# EAGLE design CC1101_reva (EAGLE 7.7.0)

## Sheet 1 of 2
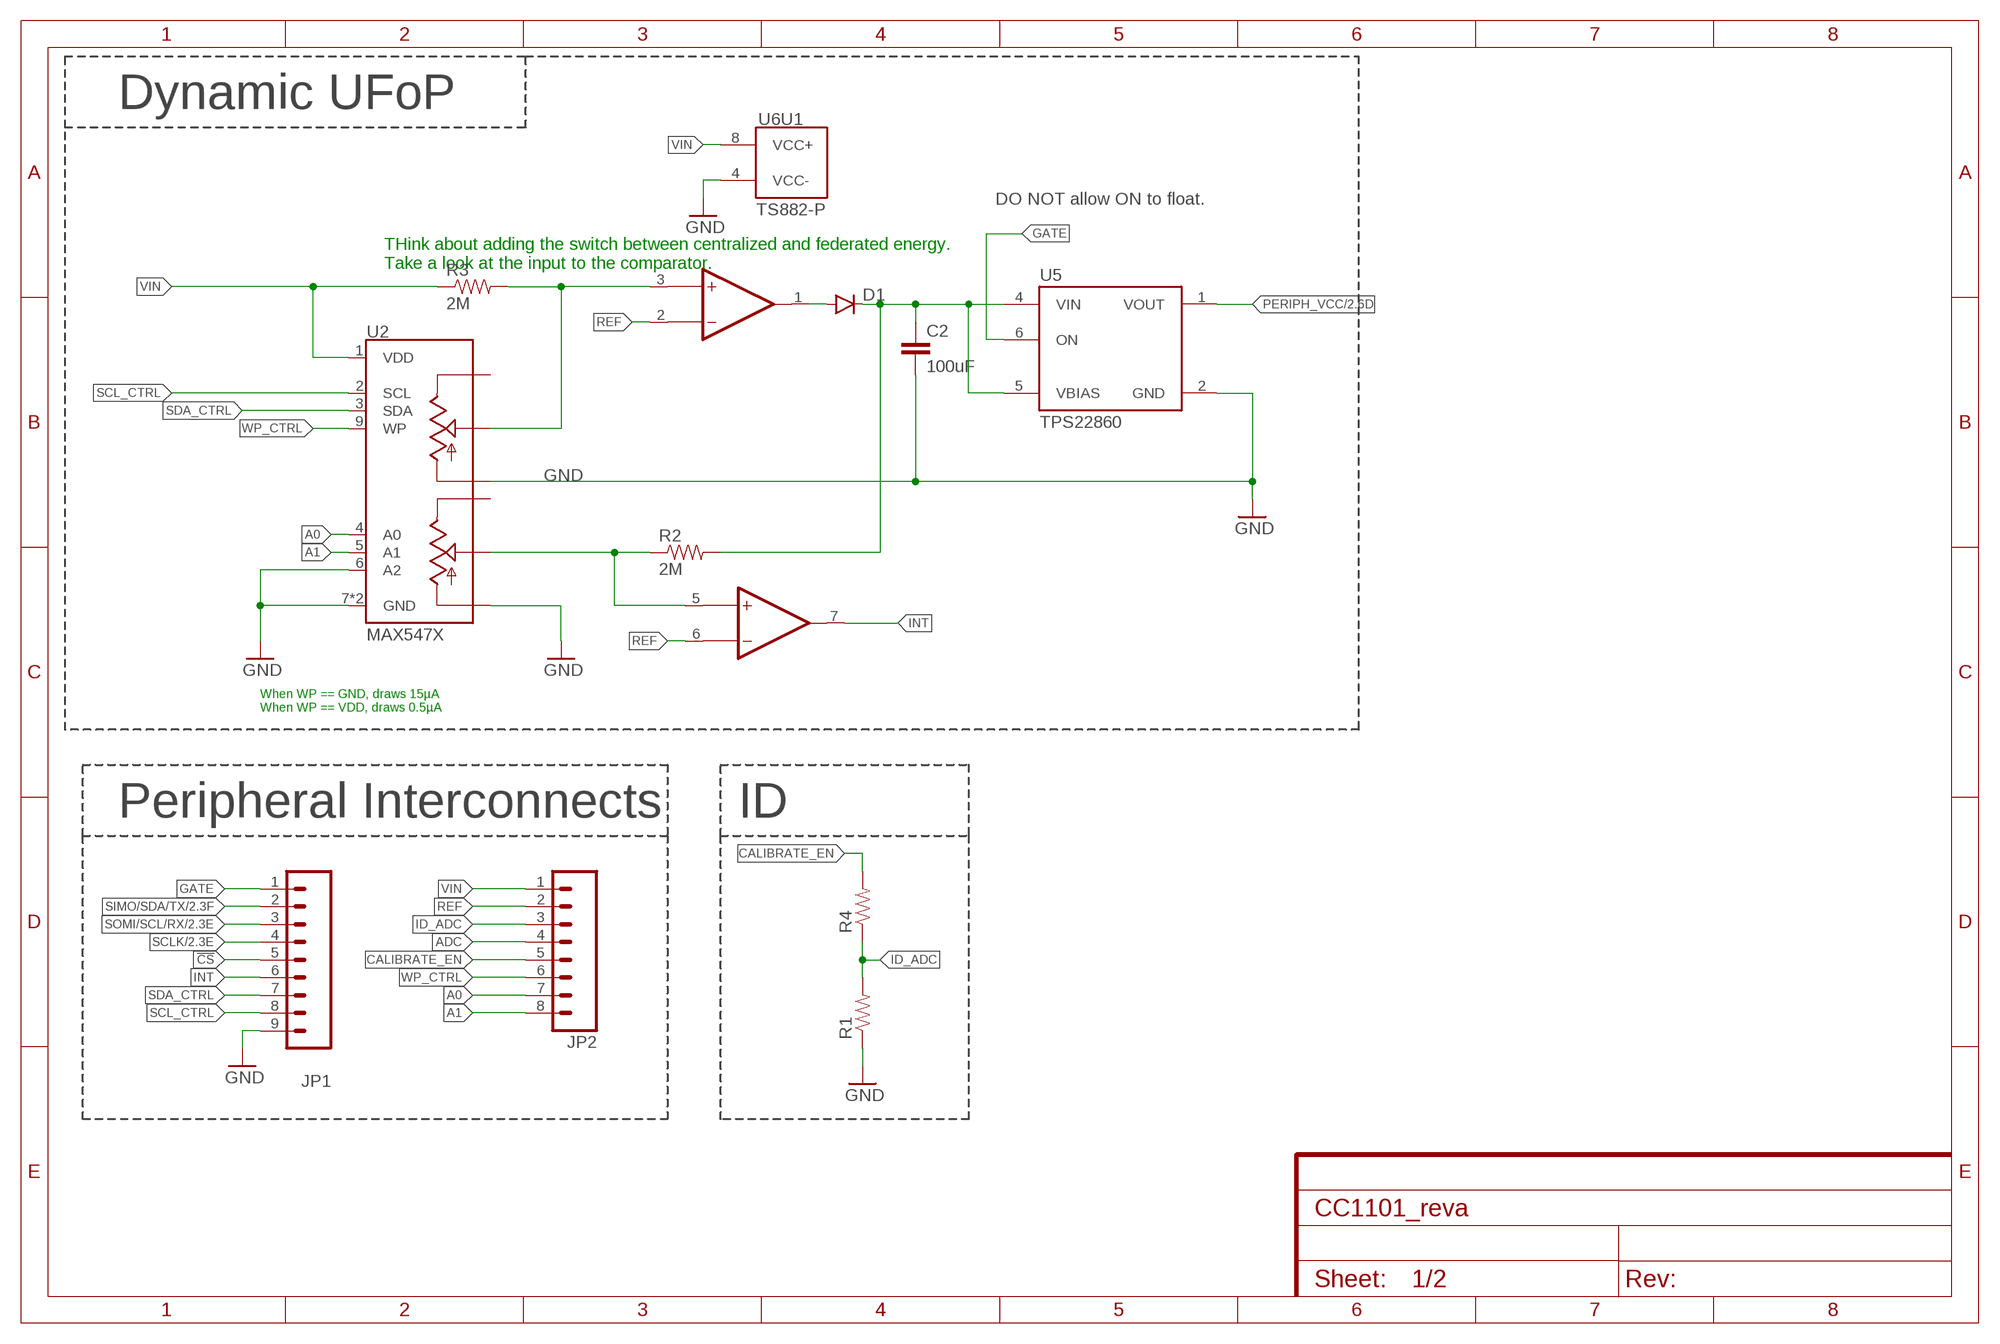
[diagram p0: schematic, sheet 1]
FRAME2 (FRAME-A4L): CNAME: Humidity Peripheral, Si7021; CREVISION: A; DESIGNER: Josiah Hester

### Parts
C2  100uF  CAP1210  [1210]
D1  DIODESOD523  [SOD523]
JP1  M091.27MM  [1X09-1.27MM]
JP2  M081.27MM  [1X08-1.27MM]
R1  R-EU0603  [0603]
R2  2M  R-EU0603  [0603]
R3  2M  R-EU0603  [0603]
R4  R-EU0603  [0603]
U2  MAX547X  [QFN16]
U5  TPS22860  [TSOT23-6]
U6  TS882-P  [UDFN8]

### Nets
!CS: JP1.5 ; also sheet 2
A0: JP2.7 U2.4(A0)
A1: JP2.8 U2.5(A1)
ADC: JP2.4
CALIBRATE_EN: JP2.5 R4.2
GATE: JP1.1 U5.6(ON)
GND: C2.2 JP1.9 R1.1 U2.6(A2) U2.7(GND) U2.10(LB) U2.13(LA) U2.TH(GND) U5.2(GND) U6.4(U1:VCC-) ; also sheet 2
ID_ADC: JP2.3 R1.2 R4.1
INT: JP1.6 U6.7(OP2:OUT1)
N$2: C2.1 D1.C R2.2 U5.4(VIN) U5.5(VBIAS)
N$4: R3.2 U2.14(WA) U6.3(OP1:IN1+)
N$5: R2.1 U2.11(WB) U6.5(OP2:IN1+)
N$11: D1.A U6.1(OP1:OUT1)
PERIPH_VCC: U5.1(VOUT) ; also sheet 2
REF: JP2.2 U6.2(OP1:IN1-) U6.6(OP2:IN1-)
SCL_CTRL: JP1.8 U2.2(SCL)
SCLK: JP1.4 ; also sheet 2
SDA_CTRL: JP1.7 U2.3(SDA)
SIMO/SDA/TX: JP1.2 ; also sheet 2
SOMI/SCL/RX: JP1.3 ; also sheet 2
VIN: JP2.1 R3.1 U2.1(VDD) U6.8(U1:VCC+)
WP_CTRL: JP2.6 U2.9(WP)
Unconnected: U2.12(HB) U2.15(HA)

### Notes on the sheet
- Dynamic UFoP
- DO NOT allow ON to float.
- THink about adding the switch between centralized and federated energy.
  Take a look at the input to the comparator.
- When WP == GND, draws 15µA
  When WP == VDD, draws 0.5µA
- Peripheral Interconnects | ID

## Sheet 2 of 2
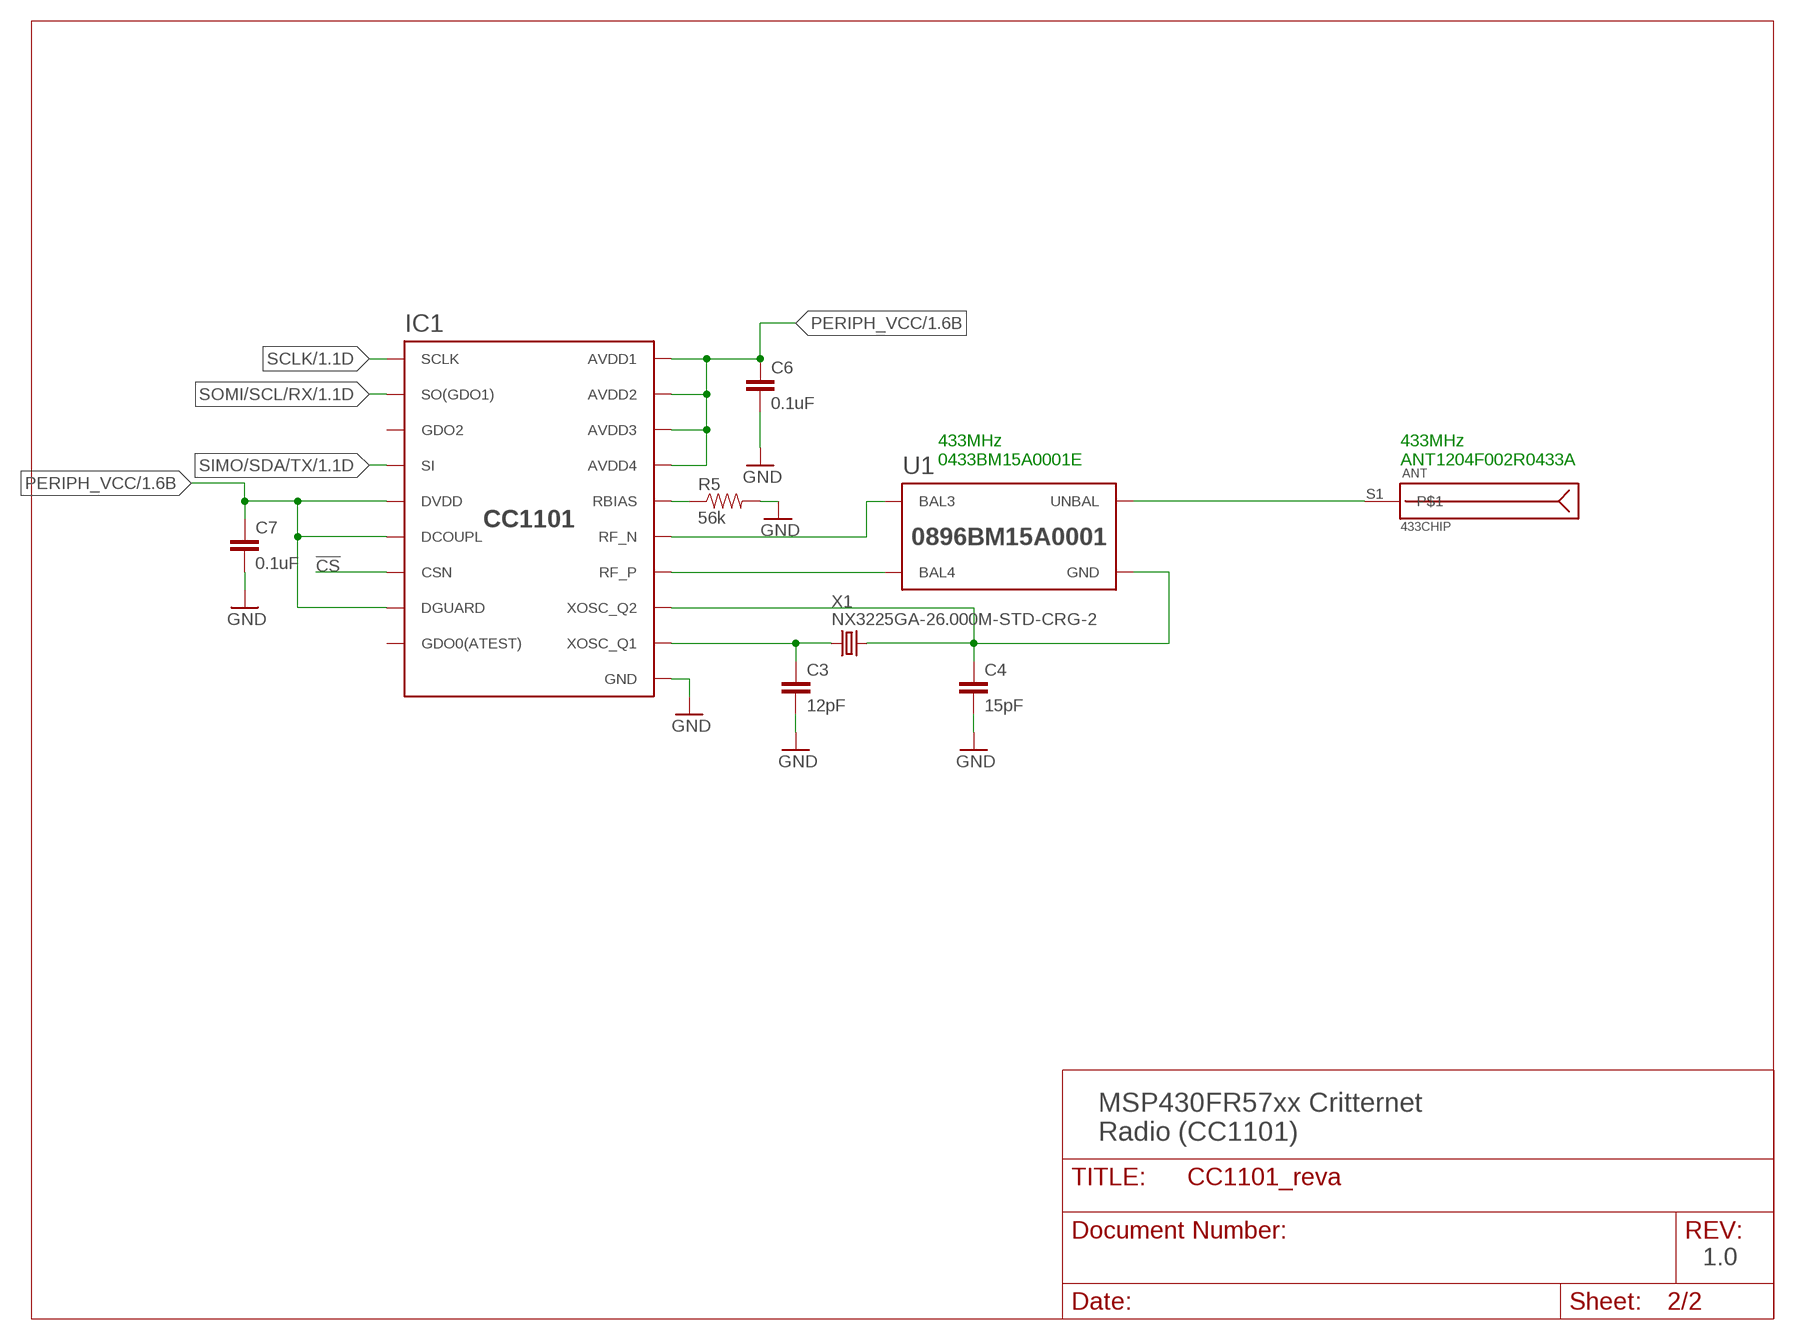
[diagram p1: schematic, sheet 2]

### Parts
ANT  433CHIP  [ANT-433-USP]
C3  12pF  C-EU0603  [0603]
C4  15pF  C-EU0603  [0603]
C6  0.1uF  C-EU0603  [0603]
C7  0.1uF  C-EU0603  [0603]
IC1  CC1101  [QLP20]
R5  56k  R-EU0603  [0603]
U1  0896BM15A0001  [0896BM15A0001]
X1  NX3225GA-26.000M-STD-CRG-2  XTAL-3.2X2.5  [XTAL-3.2X2.5]

### Nets
!CS: IC1.7(CSN) ; also sheet 1
GND: C3.2 C4.2 C6.2 C7.2 IC1.16(GND) IC1.19(GND) IC1.GND R5.2 ; also sheet 1
N$1: IC1.12(RF_P) U1.4(BAL4)
N$3: IC1.13(RF_N) U1.3(BAL3)
N$6: C3.1 IC1.8(XOSC_Q1) X1.1
N$7: IC1.17(RBIAS) R5.1
N$15: ANT.S1 U1.1(UNBAL)
PERIPH_VCC: C6.1 C7.1 IC1.4(DVDD) IC1.5(DCOUPL) IC1.9(AVDD1) IC1.11(AVDD2) IC1.14(AVDD3) IC1.15(AVDD4) IC1.18(DGUARD) ; also sheet 1
SCLK: IC1.1(SCLK) ; also sheet 1
SIMO/SDA/TX: IC1.20(SI) ; also sheet 1
SOMI/SCL/RX: IC1.2(SO(GDO1)) ; also sheet 1
XOSC_Q2: C4.1 IC1.10(XOSC_Q2) U1.2(GND) U1.5(GND) U1.6(GND) X1.3
Unconnected: IC1.3(GDO2) IC1.6(GDO0(ATEST))

### Notes on the sheet
- 433MHz
  0433BM15A0001E
- 433MHz
  ANT1204F002R0433A
- MSP430FR57xx Critternet
  Radio (CC1101)
- 1.0

## Library data of the parts
ANT = HF-Bauteile:433CHIP
C2 = SparkFun-Capacitors:CAP: Capacitor Standard 0603 ceramic capacitor, and 0.1" leaded capacitor.; DIGIKEY: 490-9969-1-ND
C3 C4 C6 C7 = tiny_passives:C-EU
D1 = SparkFun-DiscreteSemi:DIODE: Diode These are standard reverse protection diodes and small signal diodes. SMA package can handle up to about 1A. SOD-323 can handle about 200mA. What the SOD-323 package when ordering, there are some mfgs out there that are 5-pin packages.
IC1 = cc1101:CC1101
JP1 = SparkFun-Connectors:M09: Header 9 Standard 9-pin 0.1" header. Use with straight break away headers (SKU : PRT-00116), right angle break away headers (PRT-00553), swiss pins (PRT-00743), machine pins (PRT-00117), and female headers (PRT-00115).
JP2 = SparkFun-Connectors:M08: Header 8 Standard 8-pin 0.1" header. Use with straight break away headers (SKU : PRT-00116), right angle break away headers (PRT-00553), swiss pins (PRT-00743), machine pins (PRT-00117), and female headers (PRT-00115).
R1 R3-R5 = tiny_passives:R-EU
R2 = tiny_passives:R-EU; DIGIKEY: 311-2.00MHRCT-ND
U1 = otternet:0896BM15A0001
U2 = max547x:MAX547X: MAXIM MAX547X: Dual, 256-Tap, Nonvolatile, I2C-Interface, Digital Potentiometers, 400nA Iq, 250µA 12ms write The MAX5477/MAX5478/MAX5479 nonvolatile, dual, linear-taper, digital potentiometers perform the function of a mechanical potentiometer, but replace the mechanics with a simple 2-wire digital interface. Each device performs the same function as a discrete potentiometer or variable resistor and has 256 tap points. The devices feature an internal, nonvolatile EEPROM used to store the wiper position for initialization during power-up. A write-protect feature prevents accidental overwrites of the EEPROM. The fast-mode I2C-compatible serial interface allows communication at data rates up to 400kbps, minimizing board space and reducing interconnection complexity in many applications. Three address inputs allow a total of eight unique address combinations.; DIGIKEY: MAX5479ETE+-ND
U5 = tps22860:TPS22860: TI: TPS22860 Ultra-Low Leakage Load Switch The TPS22860 is a small, ultra-low leakage current, single channel load switch. The device requires a VBIAS voltage and can operate over an input voltage range of 0 V to VBIAS. It can support a maximum continuous current of 200 mA. The switch is controlled by an on/off input (ON), which is capable of interfacing directly with low-voltage control signals. The TPS22860 is available in two small, space-saving 6-pin SOT-23 and SC70 packages. The device is characterized for operation over the free-air temperature range of –40°C to 85°C.; DIGIKEY: 296-43982-1-ND
U6 = ts882:TS882-P; DIGIKEY: 497-14073-1-ND
X1 = cc1101:XTAL

## Net classes
1 Ground: width 0.203 mm, drill 0.61 mm

## Board
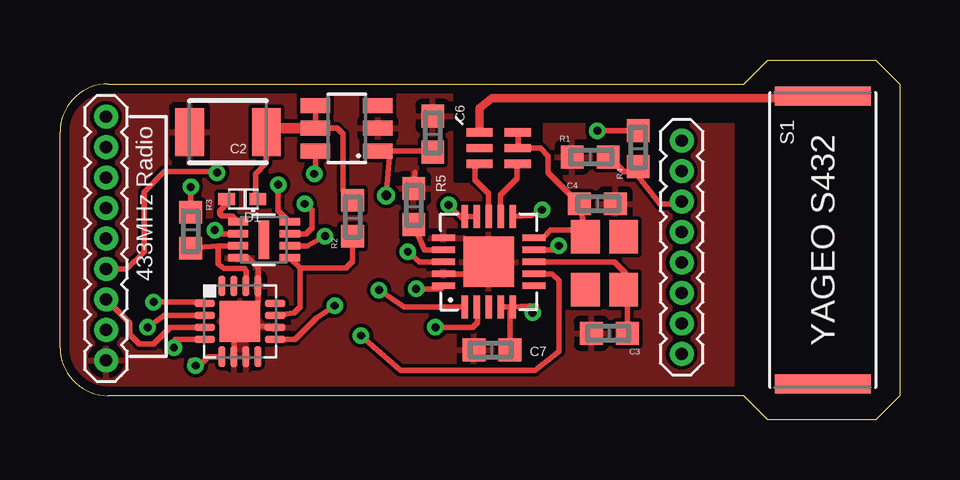
[diagram p2: board, top side]
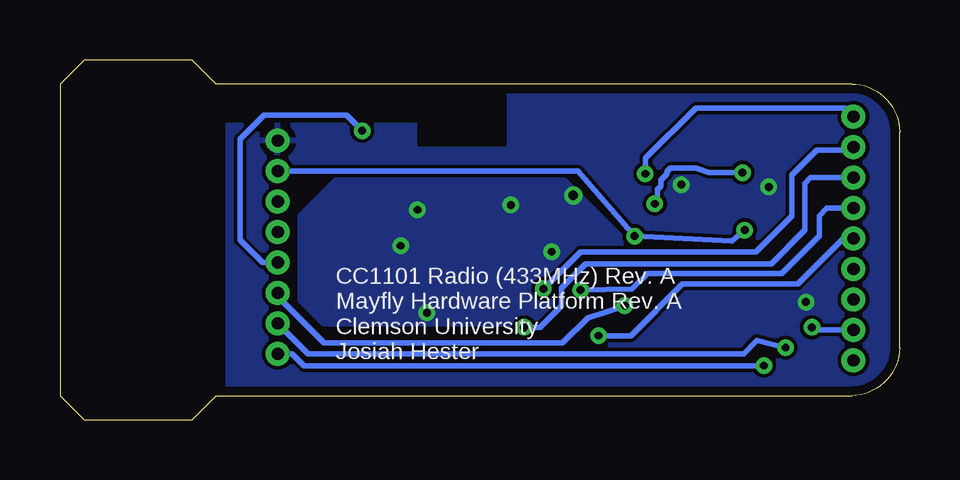
[diagram p3: board, bottom side, seen from below]

Size 35 x 15 mm. Coordinates in mm from the lower left corner, seen from the top.
Outline: 2,14 28.5,14 29.5,15 34,15 35,14 35,1 34,0 29.5,0 28.5,1 2,1 arc-90 0,3 0,12 arc-90 2,14
Copper layers (1*16): Top 0.0356mm / dielectric 1.5011mm / Bottom 0.0356mm
Design rules "LaenPCBOrder": minimum track width 6mil, minimum drill 13mil, track to track 6mil, track to pad 6mil, pad to pad 6mil, via to via 6mil, smd to smd 6mil, copper to edge 15mil, drill to drill 6mil, minimum pad ring 7mil, minimum via ring 7mil, stop-mask expansion 3mil, vias tented up to drill 0mil, thermal gap 10mil

### Footprints (pad centres in the part's own frame; a part is rotated, then mirrored left to right if it is on the bottom)
ANT-433-USP = smd 0.8 x 4: P$4 6,0; S1 -6,0
1210 = smd 1.2 x 2: 1 -1.6,0; 2 1.6,0
0603 = smd 0.95 x 0.95: 1 -0.75,0; 2 0.75,0
SOD523 = smd 0.7 x 0.5: A 0.7,0; C -0.6,0
QLP20 = smd 0.96 x 0.28: 1 -1.88,1; 2 -1.88,0.5; 3 -1.88,0; 4 -1.88,-0.5; 5 -1.88,-1; 11 1.88,-1; 12 1.88,-0.5; 13 1.88,0; 14 1.88,0.5; 15 1.88,1 | smd 0.28 x 0.96: 6 -1,-1.88; 7 -0.5,-1.88; 8 0,-1.88; 9 0.5,-1.88; 10 1,-1.88; 16 1,1.88; 17 0.5,1.88; 18 0,1.88; 19 -0.5,1.88; 20 -1,1.88 | smd 2.1 x 2.1: GND 0,0
1X09-1.27MM = drill 0.508 pad 1: 1 0,0; 2 1.27,0; 3 2.54,0; 4 3.81,0; 5 5.08,0; 6 6.35,0; 7 7.62,0; 8 8.89,0; 9 10.16,0
1X08-1.27MM = drill 0.508 pad 1: 1 0,0; 2 1.27,0; 3 2.54,0; 4 3.81,0; 5 5.08,0; 6 6.35,0; 7 7.62,0; 8 8.89,0
0896BM15A0001 = smd 0.35 x 1.1: 1 0.65,0.8; 2 0,0.8; 3 -0.65,0.8; 4 -0.65,-0.8; 5 0,-0.8; 6 0.65,-0.8
QFN16 = smd 0.85 x 0.3: 1 -1.475,0.75; 2 -1.475,0.25; 3 -1.475,-0.25; 4 -1.475,-0.75; 9 1.475,-0.75; 10 1.475,-0.25; 11 1.475,0.25; 12 1.475,0.75 | smd 0.3 x 0.85: 5 -0.75,-1.475; 6 -0.25,-1.475; 7 0.25,-1.475; 8 0.75,-1.475; 13 0.75,1.475; 14 0.25,1.475; 15 -0.25,1.475; 16 -0.75,1.475 | smd 1.7 x 1.7: TH 0,0
TSOT23-6 = smd 0.62 x 1.22: 1 -0.95,-1.3; 2 0,-1.3; 3 0.95,-1.3; 4 0.95,1.3; 5 0,1.3; 6 -0.95,1.3
UDFN8 = smd 0.3 x 0.85: 1 -0.75,-1.075; 2 -0.25,-1.075; 3 0.25,-1.075; 4 0.75,-1.075; 5 0.75,1.075; 6 0.25,1.075; 7 -0.25,1.075; 8 -0.75,1.075 | smd 1.6 x 0.45: TH 0,0
XTAL-3.2X2.5 = smd 1.4 x 1.2: 1 -1.1,-0.8; 2 1.1,-0.8; 3 1.1,0.8; 4 -1.1,0.8

### Placement (x,y rotation side)
ANT  31.8,7.49 270 top
C2  7,12 180 top
C3  22.9,3.6 180 top
C4  22.4,9 0 top
C6  15.54,11.91 90 top
C7  18.01,2.9 180 top
D1  7.65,9.2 180 top
IC1  17.87,6.58 90 top
JP1  1.92,12.63 270 top
JP2  25.92,11.63 270 top
R1  22.1,10.95 0 top
R2  12.2,8.4 90 top
R3  5.45,7.9 270 top
R4  24.1,11.3 90 top
R5  14.75,8.89 90 top
U1  18.29,11.32 90 top
U2  7.5,4.1 0 top
U5  11.95,12.15 90 top
U6  8.5,7.5 270 top
X1  22.7,6.52 90 top

### Tracks (layer width: path | path; a pad name or v marks a point on that pad's centre or on a via)
!CS  (via drill 0.33)
  Top 0.222: IC1.7 20.52,6.08 20.8,5.8 20.8,2.85 19.8,2.05 14.2,2.05 v12.55,3.5
  Bottom 0.222: JP1.5 2.35,7.55 4.25,5.65 9.05,5.65 11.2,3.5 v12.55,3.5
A0  (via drill 0.33)
  Top 0.222: v4.75,3 4.8,3.35 U2.4
  Bottom 0.222: v4.75,3 5.95,3.3 6.5,2.75 24.66,2.75 JP2.7
A1  (via drill 0.33)
  Top 0.222: v5.65,2.25 5.45,2.45 5.8,2.25 6.17,2.62 U2.5
  Bottom 0.222: JP2.8 25.32,2.74 24.83,2.25 v5.65,2.25
CALIBRATE_EN  (via drill 0.33)
  Top 0.222: v22.4,12.05 R4.2
  Bottom 0.222: JP2.5 26.55,6.55 27.5,7.5 27.5,11.7 26.5,12.7 23.05,12.7 v22.4,12.05
GATE  (via drill 0.33)
  Top 0.222: U5.6 10.65,10.65 v10.6,10.25
  Bottom 0.222: JP1.1 2.29,13 8.5,13 10.6,10.9 v10.6,10.25
GND
  Top 0.222: U2.10 7.75,3.95 U2.TH | U2.TH 8.25,4.95 U2.13 8.25,6.35 7.85,6.75 U6.4 | U2.6 7.25,3.95 U2.TH | R5.2 14.8,10.29 | IC1.19 17.58,6.08 18,6.5
  pour Top: -0.5,1 28,1 28,14.5 -0.5,14.5
ID_ADC
  Top 0.222: JP2.3 25.83,9 25,9 24.1,10.15 R4.1 23.9,10.35 23.5,10.35 22.9,10.95 R1.2
INT  (via drill 0.33)
  Top 0.222: U6.7 10.25,7.75 10.5,8 10.5,8.75 v10.2,9 | JP1.6 2.78,6.28 3.5,7 3.5,9.5 4.35,10.35 6.15,10.35 v6.55,10.3
  Bottom 0.222: v6.55,10.3 7.95,10.3 8.5,10.5 9.55,10.5 9.7,10.35 9.7,10.25 9.95,10 9.95,9.75 10.1,9.6 10.1,9.1 v10.2,9
N$1
  Top 0.222: IC1.12 18.37,9.37 19.05,10.05 19.05,10.63 U1.4
N$2
  Top 0.222: U5.4 U5.5 11.55,12.15 11.8,11.9 11.8,9.55 R2.2 | D1.C 8.15,9.2 8.15,10.25 8.6,10.7 C2.1
  Top 0.44: U5.5 8.75,12.15 C2.1
N$3
  Top 0.222: IC1.13 17.87,9.43 17.3,10 17.3,10.48 U1.3
N$4
  Top 0.222: U6.3 6.6,7.25 | 6.6,7.25 R3.2 | U2.14 7.75,6.2 7.7,6.3 6.85,6.3 6.6,6.5 6.6,7.25
N$5
  Top 0.222: U2.11 9.75,4.45 10,4.7 10,6.33 | 10,6.33 U6.5 | 10,6.33 11.93,6.33 12.2,6.6 R2.1
N$6
  Top 0.222: C3.1 23.65,4.66 X1.1 23.6,5.51 23.6,6.1 23.12,6.58 IC1.8
N$7
  Top 0.222: IC1.17 15.2,7.08 R5.1
N$9
  cutout Top: 18,14 29,14 29,12.5 20,12.5 20,10 16.5,10 16.5,14
N$10
  cutout Bottom: 16.5,14 29,14 29,12.5 20,12.5 20,11.5 16.5,11.5
N$11
  Top 0.222: U6.1 7.17,8.5 6.75,8.5 6.65,8.6 6.65,8.7 6.95,9 D1.A
N$15
  Top 0.35: U1.1 17.49,12.99 18,13.4 31.79,13.4 ANT.S1
PERIPH_VCC  (via drill 0.33, 0.4)
  Top 0.222: U5.1 13.75,11.2 | 13.75,11.2 v13.6,9.35 | v16.2,8.95 16.87,8.3 IC1.15 | IC1.15 IC1.14 | IC1.18 14.98,6.58 v14.5,7 | IC1.11 19.66,8.51 v20.1,8.75 | IC1.4 IC1.5 | IC1.5 19.85,4.75 v19.7,4.45 | C7.1 18.76,4.49 IC1.5 | 16.9,8.29 IC1.15 | IC1.9 20.77,7.08 v20.8,7.25 | 13.75,11.2 15.38,11.2 C6.1
  pour Bottom: 14,10 23.5,10 25,8.5 25,5 24,4 11.5,4 11,4.5 11,7
REF  (via drill 0.33)
  Top 0.222: v11.05,7.65 10.3,7.25 U6.6 | U6.2 6.6,7.75 v6.45,7.9
  Bottom 0.222: JP2.2 13.41,10.36 v11.05,7.65 7,7.45 v6.45,7.9
SCL_CTRL  (via drill 0.33)
  Top 0.222: v3.65,3.85 4.35,4.35 U2.2
  Bottom 0.222: JP1.8 3.54,3.74 v3.65,3.85
SCLK  (via drill 0.33)
  Top 0.222: IC1.1 15.2,4.7 14.8,4.7 14.35,4.7 v13.3,5.4
  Bottom 0.222: JP1.4 3.03,8.82 3.35,8.5 3.35,7.65 4.9,6.1 10.5,6.1 11.15,5.45 v13.3,5.4
SDA_CTRL
  Top 0.222: U2.3 4.6,3.85 3.9,3.15 3.3,3.15 2.9,3.55 2.9,4.03 JP1.7
SIMO/SDA/TX  (via drill 0.33)
  Top 0.222: 15.98,5.6 IC1.20 15.86,5.45 v14.85,5.45
  Bottom 0.222: JP1.2 2.03,11.25 3.45,11.25 4.5,10.2 4.5,8.5 6,7 13.3,7 v14.85,5.45
SOMI/SCL/RX  (via drill 0.33)
  Top 0.222: v15.65,3.85 17.2,3.85 17.4,4.05 17.4,4.68 IC1.2
  Bottom 0.222: JP1.3 3.71,10.09 3.95,9.85 3.95,7.9 5.35,6.5 13.1,6.5 14.1,5.5 14.1,4.75 15,3.85 v15.65,3.85
VIN  (via drill 0.33)
  Top 0.222: U6.8 9.1,8.72 v9.1,9.8 | R3.1 v5.45,9.7 | v3.9,4.9 5.97,4.9 U2.1
  pour Bottom (rank 2): 0,1 28,1 28,14.5 0,14.5
WP_CTRL  (via drill 0.33)
  Top 0.222: U2.9 9.8,3.35 10.7,4.25 v11.45,4.75
  Bottom 0.222: JP2.6 25.92,5.13 23.99,3.2 14.05,3.2 13,4.25 v11.45,4.75
XOSC_Q2
  Top 0.222: IC1.10 20.13,7.58 20.45,7.9 21.62,7.9 X1.3 21.9,7.85 C4.1 20.35,10.3 20.35,11 20.03,11.32 U1.5
  Top 0.254: U1.6 U1.5

### Text on the board
tPlace: 433MHz Radio
bPlace: CC1101 Radio (433MHz) Rev. A / Mayfly Hardware Platform Rev. A / Clemson University / Josiah Hester